# Altium schematic sheet [24] - REVISION HISTORY.SchDoc
size A3; DocumentNumber: 17; SheetNumber: 17; SheetTotal: 18
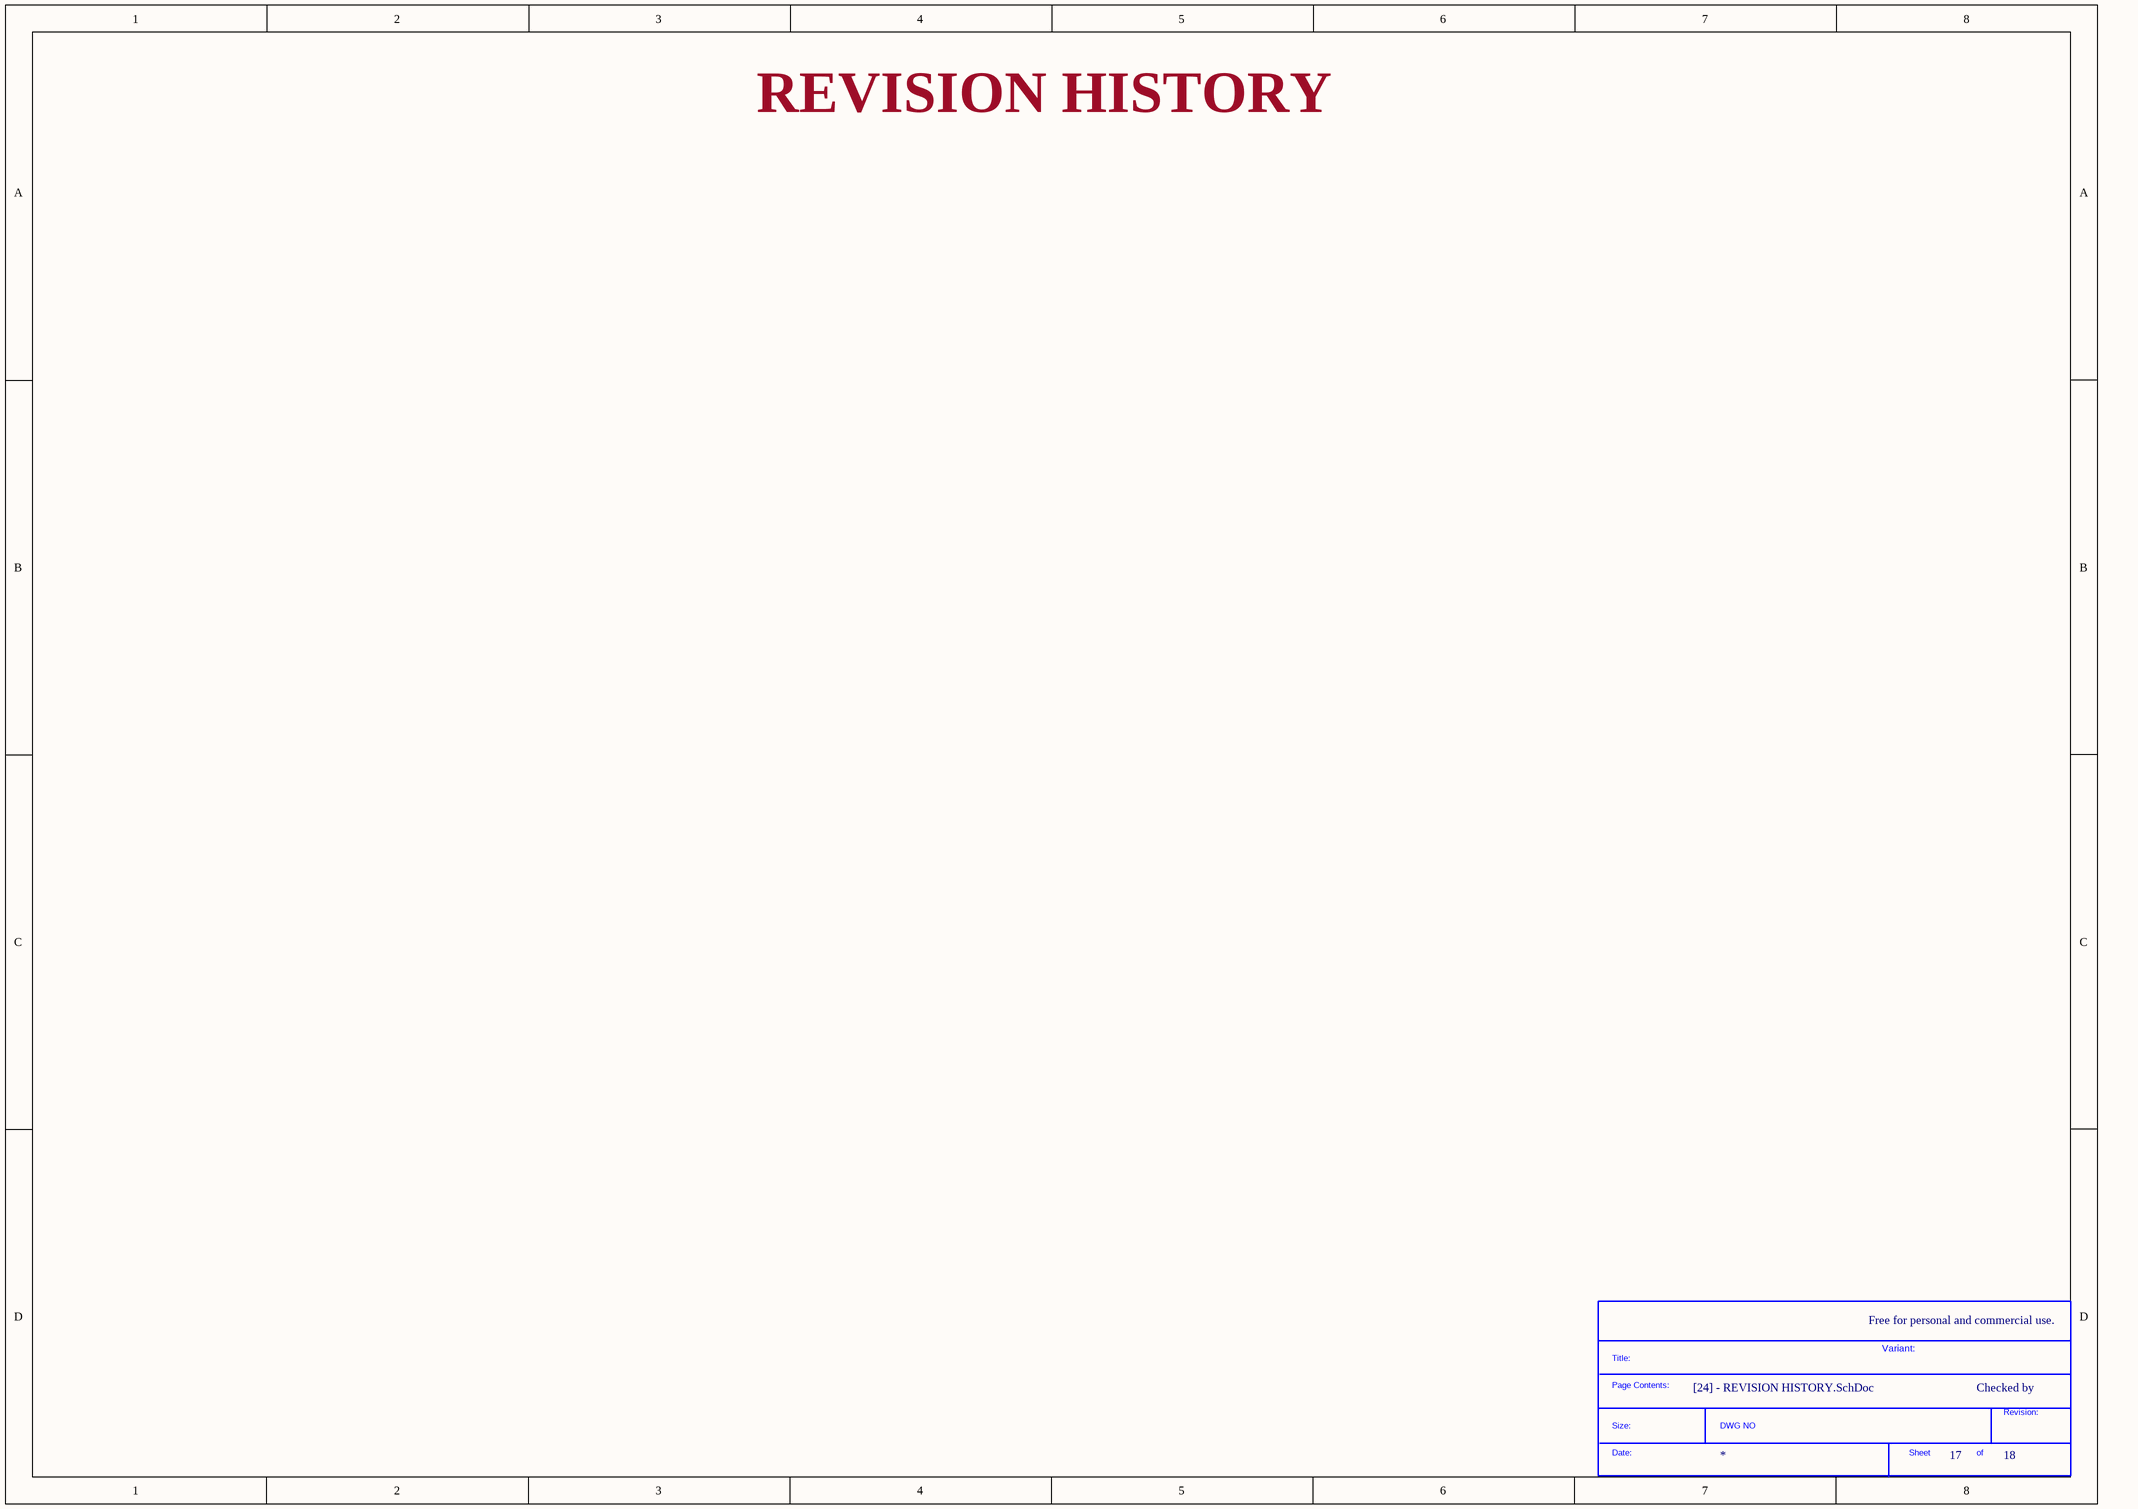
[diagram p0: [24] - REVISION HISTORY.SchDoc]

## Parts
*  SDTitleBlock  (value not drawn)  (graphical)

## Notes on the sheet
- REVISION HISTORY
- Free for personal and commercial use.
- Variant:
- Checked by
- (in symbol SDTitleBlock) Title:; Page Contents:; Revision:; Size:; DWG NO; Date:; Sheet; of